# EAGLE schematic Seeeduino GPRS v1.0 (EAGLE 6.4)
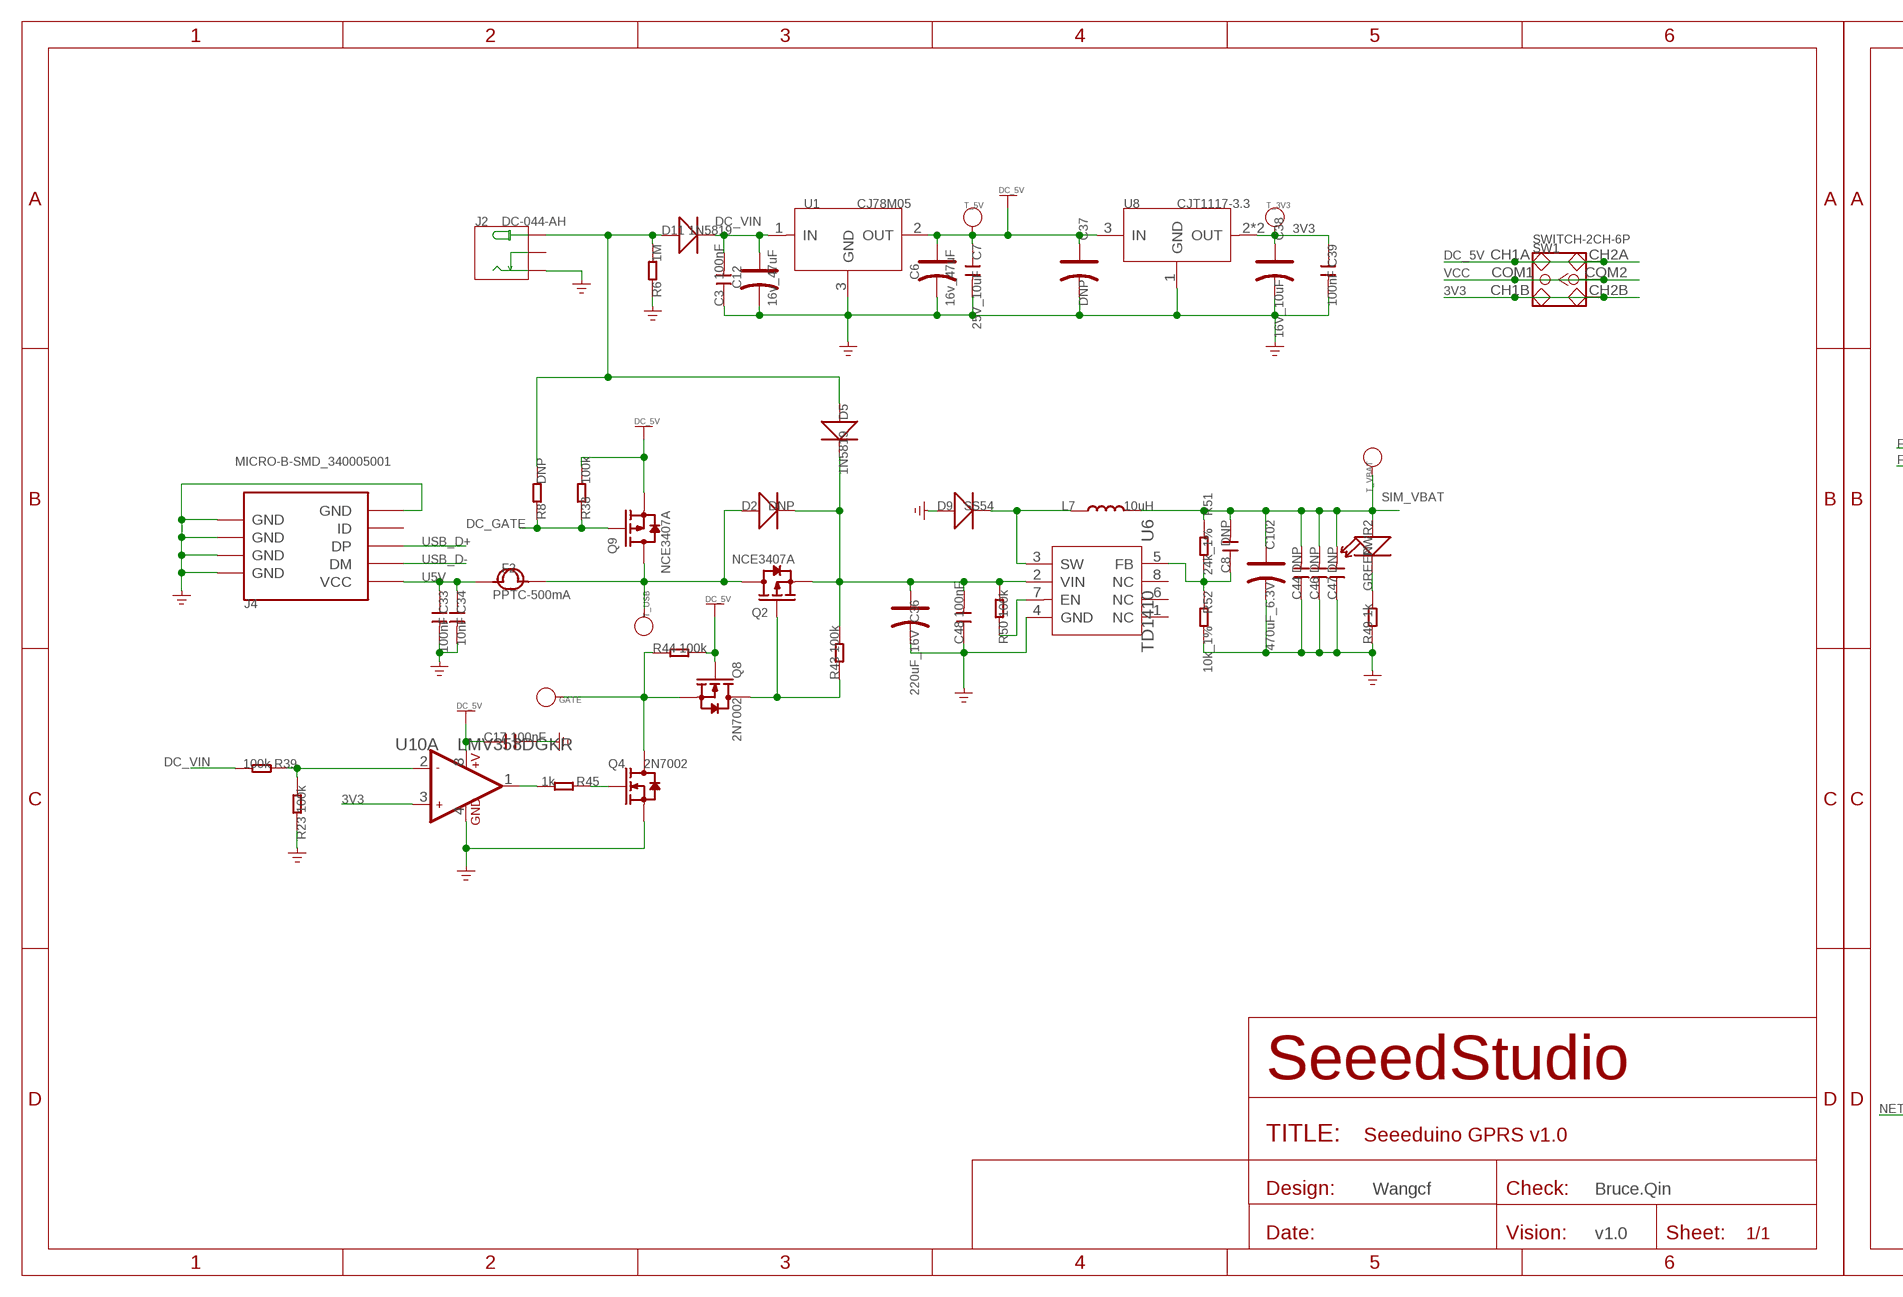
[diagram p0: schematic, sheet 1, part 1 of 3]
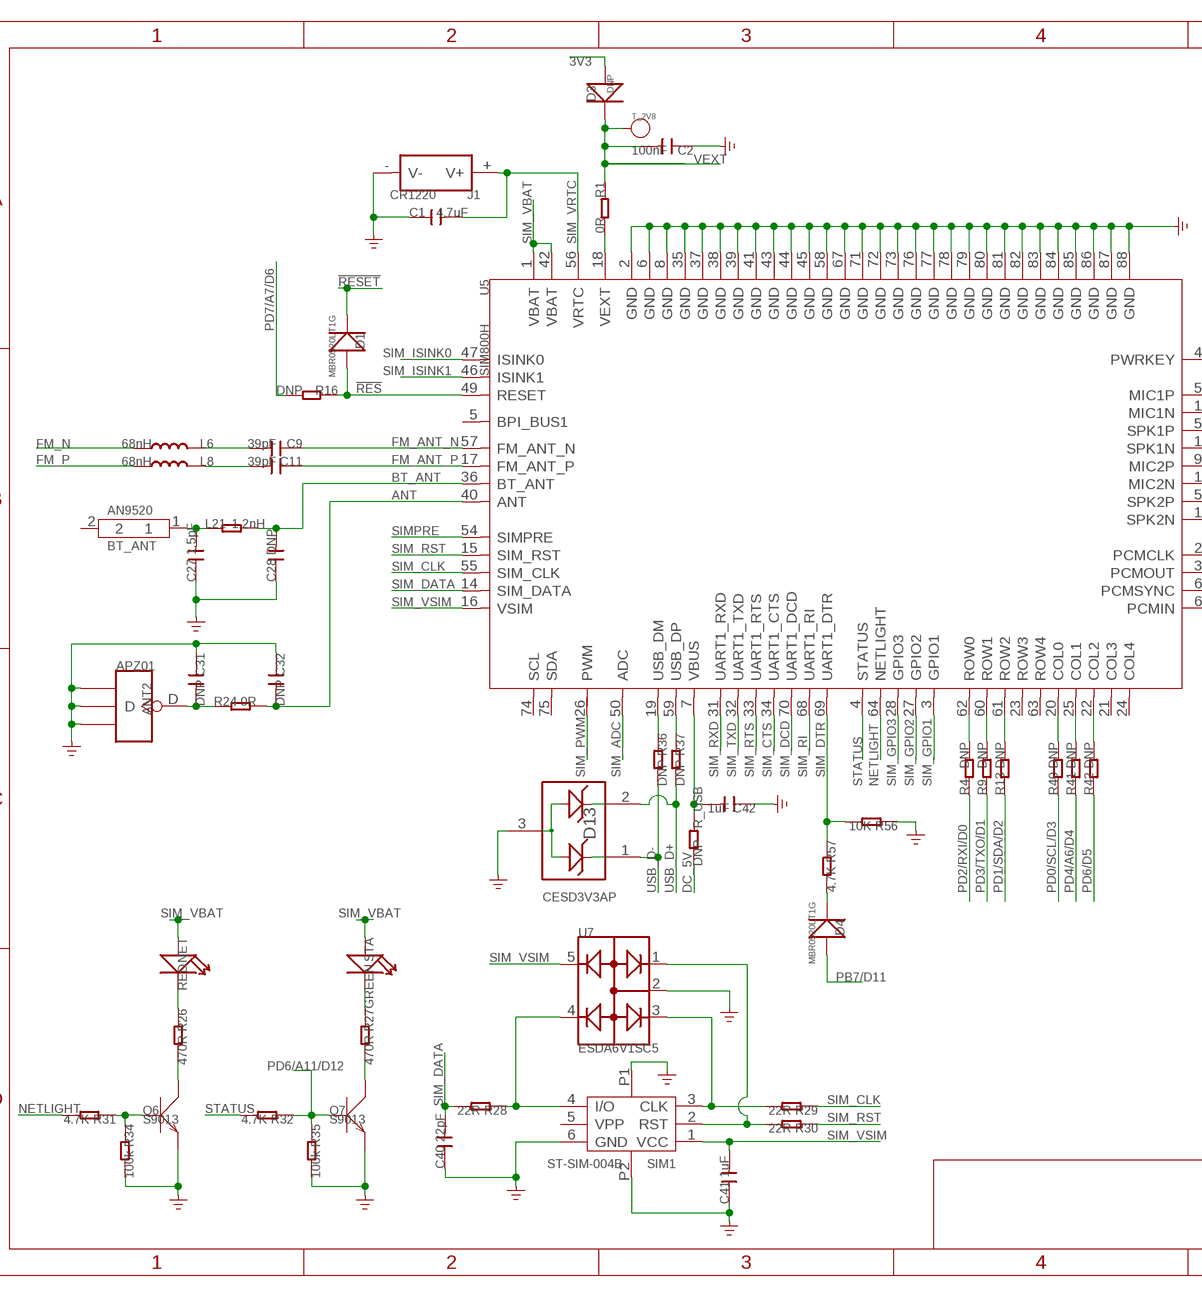
[diagram p1: schematic, sheet 1, part 2 of 3]
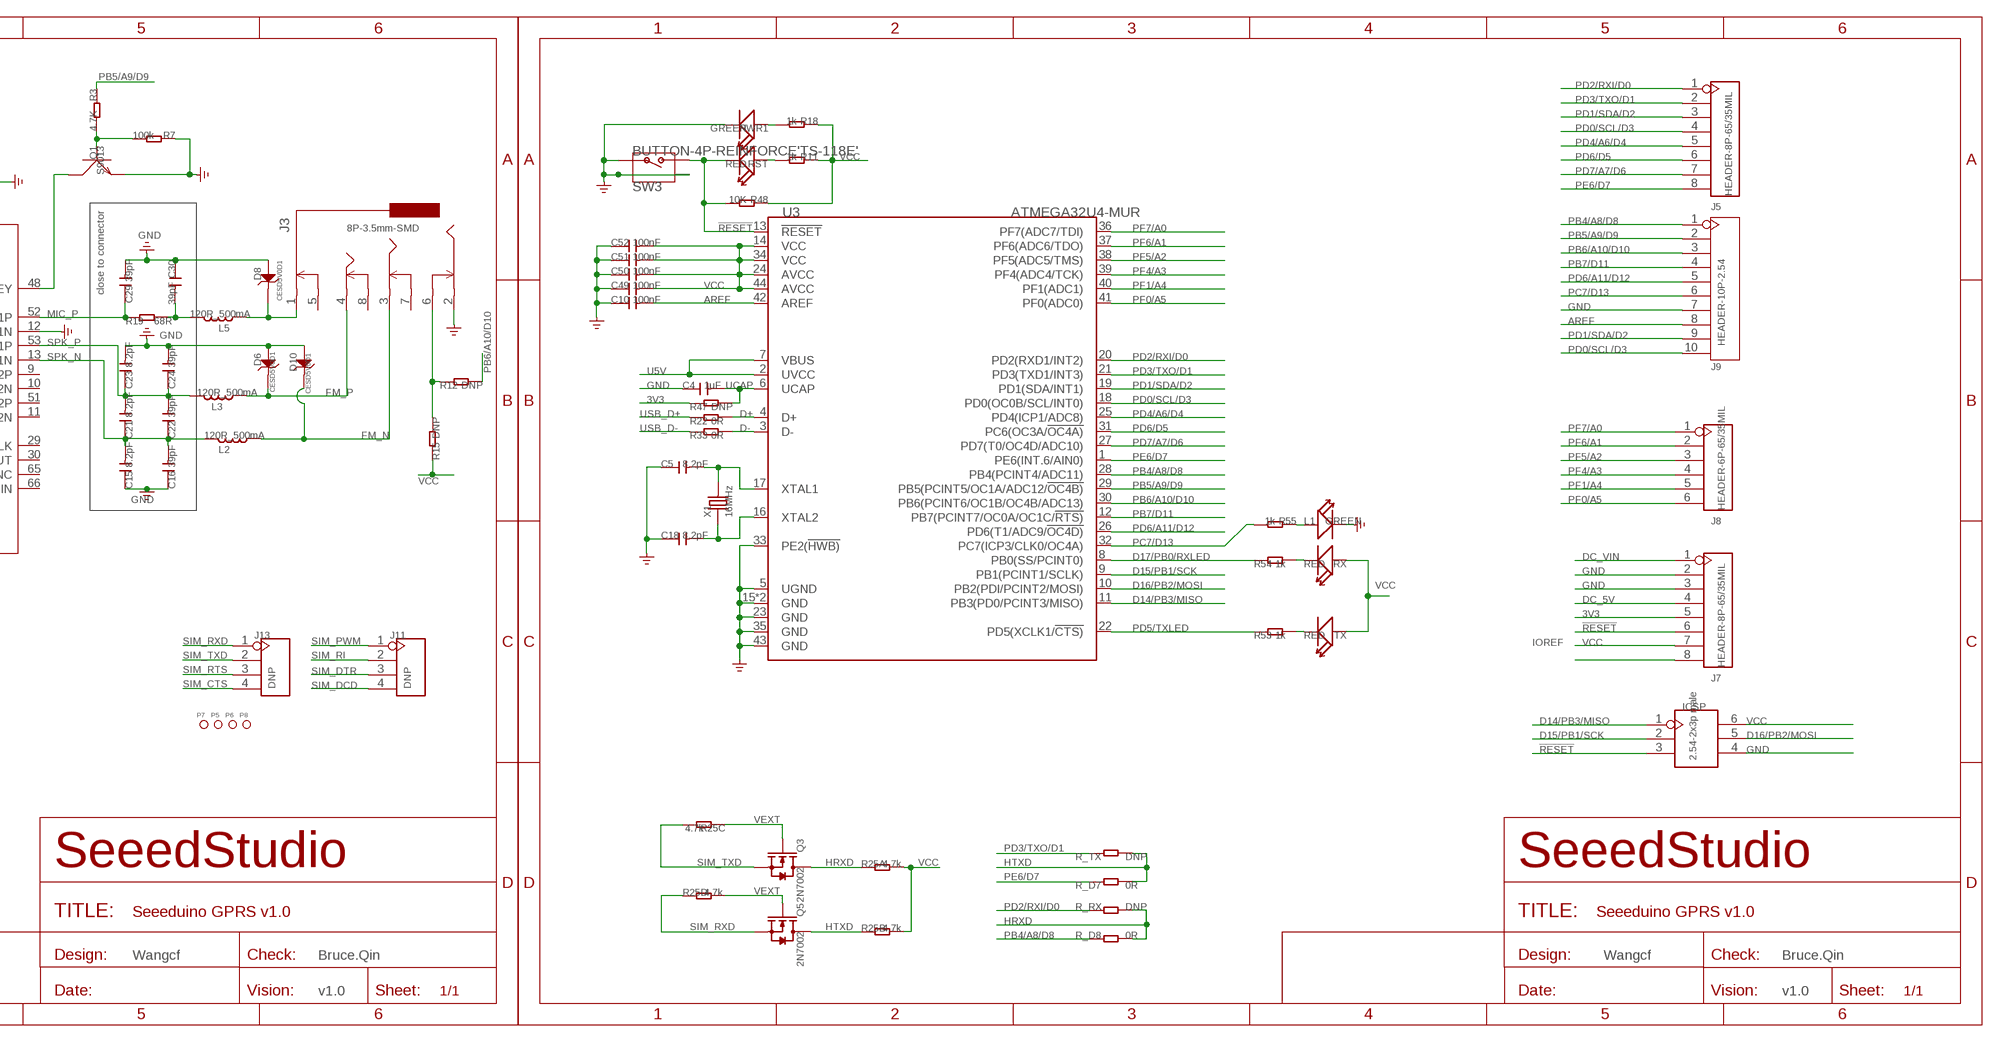
[diagram p2: schematic, sheet 1, part 3 of 3]

## Parts
ANT2  APZ01  ANTENNA-U-FL  [4P-U-FL]
BT_ANT  AN9520  ANTENNA-CERAMICS'AN9520'  [2P-9.5X2.1X1MM]
C1  4.7uF  C-0805  [C0805]
C2  100nF  C-0603  [C0603]
C3  100nF  C-0603  [C0603]
C4  1uF  C-0603  [C0603]
C5  8.2pF  C-0603  [C0603]
C6  16v_47uF  CAP-AVX-C  [AVX-C]
C7  25V_10uF  C-0805  [C0805]
C8  DNP  C-0603  [C0603]
C9  39pF  C-0603  [C0603]
C10  100nF  C-0603  [C0603]
C11  39pF  C-0603  [C0603]
C12  16v_47uF  CAP-AVX-C  [AVX-C]
C15  8.2pF  C-0603  [C0603]
C16  39pF  C-0603  [C0603]
C17  100nF  C-0603  [C0603]
C18  8.2pF  C-0603  [C0603]
C21  8.2pF  C-0603  [C0603]
C22  39pF  C-0603  [C0603]
C23  8.2pF  C-0603  [C0603]
C24  39pF  C-0603  [C0603]
C27  1.5pF  C-0603  [C0603]
C28  DNP  C-0603  [C0603]
C29  39pF  C-0603  [C0603]
C30  39pF  C-0603  [C0603]
C31  DNP  C-0603  [C0603]
C32  DNP  C-0603  [C0603]
C33  100nF  C-0603  [C0603]
C34  10nF  C-0603  [C0603]
C36  220uF_16V  CAP-ELECTRO-D  [ELECTRO-SMD-D-5.6MM]
C37  DNP  CAP-AVX-A  [AVX-A]
C38  16V_10uF  CAP-AVX-A  [AVX-A]
C39  100nF  C-0603  [C0603]
C40  22pF  C-0603  [C0603]
C41  1uF  C-0603  [C0603]
C42  1uF  C-0603  [C0603]
C44  DNP  C-0603  [C0603]
C46  DNP  C-0603  [C0603]
C47  DNP  C-0603  [C0603]
C48  100nF  C-0603  [C0603]
C49  100nF  C-0603  [C0603]
C50  100nF  C-0603  [C0603]
C51  100nF  C-0603  [C0603]
C52  100nF  C-0603  [C0603]
C102  470uF_6.3V  CAP-AVX-D  [AVX-D]
D1  MBR0520LT1G  D'1206'  [SOD123]
D2  DNP  D'B130L-13-F'  [SMA]
D3  DNP  D'1206'  [SOD123]
D4  MBR0520LT1G  D'1206'  [SOD123]
D5  1N5819  D'B130L-13-F'  [SMA]
D6  CESD5V0D1  D-ESD  [SOD123-2.7X1.6]
D8  CESD5V0D1  D-ESD  [SOD123-2.7X1.6]
D9  SS54  D'MBRS240LT3'  [SMB]
D10  CESD5V0D1  D-ESD  [SOD123-2.7X1.6]
D11  1N5819  D'B130L-13-F'  [SMA]
D13  CESD3V3AP  D-ESD-3P  [SOT23]
F2  PPTC-500mA  FUSE  [1206]
GATE  DNP  PAD-TEST-POINT-CIRCLE'4545'  [TP_4545]
ICSP  2.54-2x3p male  HEADER-2X3P-2.54  [2X3P-2.54]
J1  CR1220  HOLDER-BAT  [SMD-CR1220-2]
J2  DC-044-AH  DC-044  [DC-404]
J3  8P-3.5mm-SMD  AUDIO-8P'PJ-3536-L6S'  [8P-3.5-SMD]
J4  MICRO-B-SMD_340005001  USB-MINIUSB-5P-MICRO  [MICRO-USB]
J5  HEADER-8P-65/35MIL  [8P-2.54-65/35MIL]
J7  HEADER-8P-65/35MIL  [8P-2.54-65/35MIL]
J8  HEADER-6P-65/35MIL  [6P-2.54-65/35MIL]
J9  HEADER-10P-2.54  [10P-2.54]
J11  DNP  HEADER-4P-65/35MIL  [4P-65/35MIL]
J13  DNP  HEADER-4P-65/35MIL  [4P-65/35MIL]
L1  GREEN  LED'0603'  [LED-0603]
L2  120R_500mA  L'0603'  [L0603]
L3  120R_500mA  L'0603'  [L0603]
L5  120R_500mA  L'0603'  [L0603]
L6  68nH  L'0603'  [L0603]
L7  10uH  L'0630'  [L0630]
L8  68nH  L'0603'  [L0603]
L21  1.2nH  R-0603  [R0603]
NET  RED  LED'0603'  [LED-0603]
P5  DNP  PAD-MARK  [ROUND-MARK-1.0]
P6  DNP  PAD-MARK  [ROUND-MARK-1.0]
P7  DNP  PAD-MARK  [ROUND-MARK-1.0]
P8  DNP  PAD-MARK  [ROUND-MARK-1.0]
PWR1  GREEN  LED'0603'  [LED-0603]
PWR2  GREEN  LED'0603'  [LED-0603]
Q1  S9013  TRANSISTOR-NPN-SOT23  [SOT23]
Q2  NCE3407A  MOSFET-P'SI2323CDS/SI2305DS<BR>'  [SOT23]
Q3  2N7002  MOSFET-N'SOT23'  [SOT23]
Q4  2N7002  MOSFET-N'SOT23'  [SOT23]
Q5  2N7002  MOSFET-N'SOT23'  [SOT23]
Q6  S9013  TRANSISTOR-NPN-SOT23  [SOT23]
Q7  S9013  TRANSISTOR-NPN-SOT23  [SOT23]
Q8  2N7002  MOSFET-N'SOT23'  [SOT23]
Q9  NCE3407A  MOSFET-P'SI2323CDS/SI2305DS<BR>'  [SOT23]
R1  0R  R-0603  [R0603]
R3  4.7K  R-0603  [R0603]
R4  DNP  R-0603  [R0603]
R6  1M  R-0603  [R0603]
R7  100k  R-0603  [R0603]
R8  DNP  R-0603  [R0603]
R9  DNP  R-0603  [R0603]
R11  1k  R-0603  [R0603]
R12  DNP  R-0603  [R0603]
R13  DNP  R-0603  [R0603]
R15  DNP  R-0603  [R0603]
R16  DNP  R-0603  [R0603]
R18  1k  R-0603  [R0603]
R19  68R  R-0603  [R0603]
R22  0R  R-0603  [R0603]
R23  100k  R-0603  [R0603]
R24  0R  R-0603  [R0603]
R25  4.7k  R-4R-1206  [1206-8-3.3X2.4]
R26  470R  R-0603  [R0603]
R27  470R  R-0603  [R0603]
R28  22R  R-0603  [R0603]
R29  22R  R-0603  [R0603]
R30  22R  R-0603  [R0603]
R31  4.7K  R-0603  [R0603]
R32  4.7K  R-0603  [R0603]
R33  0R  R-0603  [R0603]
R34  100k  R-0603  [R0603]
R35  100k  R-0603  [R0603]
R36  DNP  R-0603  [R0603]
R37  DNP  R-0603  [R0603]
R38  100k  R-0603  [R0603]
R39  100k  R-0603  [R0603]
R40  DNP  R-0603  [R0603]
R41  DNP  R-0603  [R0603]
R42  DNP  R-0603  [R0603]
R43  100k  R-0603  [R0603]
R44  100k  R-0603  [R0603]
R45  1k  R-0603  [R0603]
R47  DNP  R-0603  [R0603]
R48  10K  R-0603  [R0603]
R49  1k  R-0603  [R0603]
R50  100k  R-0603  [R0603]
R51  24k_1%  R-0603  [R0603]
R52  10k_1%  R-0603  [R0603]
R53  1k  R-0603  [R0603]
R54  1k  R-0603  [R0603]
R55  1k  R-0603  [R0603]
R56  10K  R-0603  [R0603]
R57  4.7K  R-0603  [R0603]
R_D7  0R  R-0603  [R0603]
R_D8  0R  R-0603  [R0603]
R_RX  DNP  R-0603  [R0603]
R_TX  DNP  R-0603  [R0603]
R_USB  DNP  R-0603  [R0603]
RST  RED  LED'0603'  [LED-0603]
RX  RED  LED'0603'  [LED-0603]
SIM1  ST-SIM-004B  SIM-CARD'ST-SIM-004B'  [6P-1.8]
STA  GREEN  LED'0603'  [LED-0603]
SW1  SWITCH-2CH-6P  SWITCH-2CH-6P'MS-22D18'  [6P-2CH-2.5-9.1X3.5X3.2H]
SW3  BUTTON-4P-REINFORCE'TS-118E'  [4P-SMD-7X3.5X3.5H]
T_2V8  DNP  PAD-TEST-POINT-CIRCLE'4545'  [TP_4545]
T_3V3  DNP  PAD-TEST-POINT-CIRCLE'4545'  [TP_4545]
T_5V  DNP  PAD-TEST-POINT-CIRCLE'4545'  [TP_4545]
T_USB  DNP  PAD-TEST-POINT-CIRCLE'4545'  [TP_4545]
T_VBAT  DNP  PAD-TEST-POINT-CIRCLE'4545'  [TP_4545]
TX  RED  LED'0603'  [LED-0603]
U1  CJ78M05  78M05-TO252  [TO252]
U3  ATMEGA32U4-MUR  ATMEGA32U4-MU  [QFN44]
U5  SIM800H  [88P-17.8X15.8X2.4H]
U6  TD1410  [SOP8]
U7  ESDA6V1SC5  D-ESD-ESDA6V1SC5-SOT23-5L  [SOT23-5L]
U8  CJT1117-3.3  LD1117S  [SOT-223]
U10  LMV358DGKR  LMV358DGK  [MSOP8]
X1  16MHz  CRYSTAL'5032'  [2P-SMD-5X3.2]

## Nets
3V3: C38.+ C39.1 D3.+ J7.5 R47.1 SW1.CH1B SW1.CH2B T_3V3.T U8.2(OUT) U8.TER(OUT) U10.3(A:+IN1)
!RES: D1.+ R16.1 U5.49(RESET)
!RESET: D1.- ICSP.3 J7.6 R48.2 RST.- SW3.2 U3.13(!RESET)
ANT: C32.2 R24.2 U5.40(ANT)
AREF: C10.2 J9.8 U3.42(AREF)
BT_ANT: C28.2 L21.2 U5.36(BT_ANT)
D14/PB3/MISO: ICSP.1 U3.11(PB3(PD0/PCINT3/MISO))
D15/PB1/SCK: ICSP.2 U3.9(PB1(PCINT1/SCLK))
D16/PB2/MOSI: ICSP.5 U3.10(PB2(PDI/PCINT2/MOSI))
D17/PB0/RXLED: R54.1 U3.8(PB0(SS/PCINT0))
D+: R22.2 U3.4(D+)
D-: R33.2 U3.3(D-)
DC_5V: C6.+ C7.1 C17.1 C37.+ J7.4 Q8.1(G) Q9.2(S) R38.2 R44.2 R_USB.2 SW1.CH1A SW1.CH2A T_5V.T U1.2(OUT) U8.3(IN) U10.8(A:+V)
DC_GATE: GATE.T Q4.3(D) Q8.2(S) Q9.1(G) R8.1 R38.1 R44.1
DC_VIN: C3.2 C12.+ D11.1(-) J7.1 R39.2 U1.1(IN)
FM_ANT: D8.2 J3.1 L5.2
FM_ANT_N: C9.1 U5.57(FM_ANT_N)
FM_ANT_P: C11.1 U5.17(FM_ANT_P)
FM_N: D10.2 J3.3 L2.2 L6.2
FM_P: D6.2 J3.4 L3.2 L8.2
GND: ANT2.GND1 ANT2.GND2 ANT2.GND3 C1.1 C2.1 C3.1 C4.1 C5.1 C6.- C7.2 C10.1 C12.- C15.1 C16.1 C17.2 C18.1 C23.2 C24.2 C27.1 C28.1 C29.2 C30.1 C31.1 C32.1 C33.2 C34.2 C36.- C37.- C38.- C39.2 C40.1 C41.1 C42.1 C44.1 C46.1 C47.1 C48.1 C49.1 C50.1 C51.1 C52.1 C102.- D6.1 D8.1 D9.+ D10.1 D13.3 ICSP.4 J1.-(V-) J2.- J3.2 J4.5(GND) J4.S1(GND) J4.S2(GND) J4.S3(GND) J4.S4(GND) J4.S5(GND) J4.S6(GND) J7.2 J7.3 J9.7 L1.- PWR1.- Q1.2(E) Q4.2(S) Q6.2(E) Q7.2(E) R6.1 R7.1 R23.1 R34.2 R35.2 R49.1 R52.2 R56.1 SIM1.6(GND) SIM1.P1 SIM1.P2 SW3.1 SW3.S1 SW3.S2 U1.3(GND) U3.5(UGND) U3.15(GND) U3.23(GND) U3.33(PE2(!HWB)) U3.35(GND) U3.43(GND) U3.TAB(GND) U5.2(GND) U5.6(GND) U5.8(GND) U5.12(MIC1N) U5.35(GND) U5.37(GND) U5.38(GND) U5.39(GND) U5.41(GND) U5.43(GND) U5.44(GND) U5.45(GND) U5.58(GND) U5.67(GND) U5.71(GND) U5.72(GND) U5.73(GND) U5.76(GND) U5.77(GND) U5.78(GND) U5.79(GND) U5.80(GND) U5.81(GND) U5.82(GND) U5.83(GND) U5.84(GND) U5.85(GND) U5.86(GND) U5.87(GND) U5.88(GND) U6.4(GND) U7.2 U8.1(GND) U10.4(A:GND)
HRXD: Q3.3(D) R25.1 R_D8.2 R_RX.2
HTXD: Q5.3(D) R25.2 R_D7.2 R_TX.2
I/O: R28.1 SIM1.4(I/O) U7.4
MIC_P: C29.1 R19.1 U5.52(MIC1P)
N$2: Q6.1(B) R31.1 R34.1
N$3: Q6.3(C) R26.2
N$4: D4.- R57.2
N$5: R1.2 U5.18(VEXT)
N$6: J7.8
N$7: R23.2 R39.1 U10.2(A:-IN1)
N$8: J3.6 R12.1 R15.2
N$9: R36.1 U5.19(USB_DM)
N$10: C11.2 L8.1
N$11: Q1.1(B) R3.2 R7.2
N$12: C9.2 L6.1
N$13: R30.2 SIM1.2(RST) U7.1
N$14: R29.2 SIM1.3(CLK) U7.3
N$16: R11.2 RST.+
N$17: R37.1 U5.59(USB_DP)
N$18: D2.2(+) F2.2 Q2.3(D) Q9.3(D) T_USB.T
N$19: C42.2 R_USB.1 U5.7(VBUS)
N$20: R4.2 U5.62(ROW0)
N$21: R9.2 U5.60(ROW1)
N$22: R13.2 U5.61(ROW2)
N$26: D5.2(+) D11.2(+) J2.+ R6.2 R8.2
N$27: R45.2 U10.1(A:OUT1)
N$29: NET.- R26.1
N$30: C30.2 L5.1 R19.2
N$31: PWR1.+ R18.2
N$33: R40.2 U5.20(COL0)
N$34: R41.2 U5.25(COL1)
N$35: R42.2 U5.22(COL2)
N$36: Q2.1(G) Q8.3(D) R43.1
N$37: Q4.1(G) R45.1
N$38: C5.2 U3.17(XTAL1) X1.2
N$39: PWR2.- R49.2
N$40: R50.1 U6.7(EN)
N$41: C18.2 U3.16(XTAL2) X1.1
N$42: R53.2 TX.-
N$43: C36.+ C48.2 D2.1(-) D5.1(-) Q2.2(S) R43.2 R50.2 U6.2(VIN)
N$44: C8.1 R51.2 R52.1 U6.5(FB)
N$45: D9.- L7.1 U6.3(SW)
N$46: R54.2 RX.-
N$47: L1.+ R55.1
N$56: Q7.3(C) R27.2
N$57: R27.1 STA.-
N$58: BT_ANT.1 C27.2 L21.1
N$59: ANT2.D C31.2 R24.1
NETLIGHT: R31.2 U5.64(NETLIGHT)
PB4/A8/D8: J9.1 R_D8.1 U3.28(PB4(PCINT4/ADC11))
PB5/A9/D9: J9.2 R3.1 U3.29(PB5(PCINT5/OC1A/ADC12/!OC4B))
PB6/A10/D10: J9.3 R12.2 U3.30(PB6(PCINT6/OC1B/OC4B/ADC13))
PB7/D11: D4.+ J9.4 U3.12(PB7(PCINT7/OC0A/OC1C/!RTS))
PC7/D13: J9.6 R55.2 U3.32(PC7(ICP3/CLK0/OC4A))
PD0/SCL/D3: J5.4 J9.10 R40.1 U3.18(PD0(OC0B/SCL/INT0))
PD1/SDA/D2: J5.3 J9.9 R13.1 U3.19(PD1(SDA/INT1))
PD2/RXI/D0: J5.1 R4.1 R_RX.1 U3.20(PD2(RXD1/INT2))
PD3/TXO/D1: J5.2 R9.1 R_TX.1 U3.21(PD3(TXD1/INT3))
PD4/A6/D4: J5.5 R41.1 U3.25(PD4(ICP1/ADC8))
PD5/TXLED: R53.1 U3.22(PD5(XCLK1/!CTS))
PD6/A11/D12: J9.5 Q7.1(B) R32.1 R35.1 U3.26(PD6(T1/ADC9/!OC4D))
PD6/D5: J5.6 R42.1 U3.31(PC6(OC3A/!OC4A))
PD7/A7/D6: J5.7 R16.2 U3.27(PD7(T0/OC4D/ADC10))
PE6/D7: J5.8 R_D7.1 U3.1(PE6(INT.6/AIN0))
PF0/A5: J8.6 U3.41(PF0(ADC0))
PF1/A4: J8.5 U3.40(PF1(ADC1))
PF4/A3: J8.4 U3.39(PF4(ADC4/TCK))
PF5/A2: J8.3 U3.38(PF5(ADC5/TMS))
PF6/A1: J8.2 U3.37(PF6(ADC6/TDO))
PF7/A0: J8.1 U3.36(PF7(ADC7/TDI))
PWRKEY: Q1.3(C) U5.48(PWRKEY)
SIM_ADC: U5.50(ADC)
SIM_CLK: R29.1 U5.55(SIM_CLK)
SIM_CTS: J13.4 U5.34(UART1_CTS)
SIM_DATA: C40.2 R28.2 U5.14(SIM_DATA)
SIM_DCD: J11.4 U5.70(UART1_DCD)
SIM_DTR: J11.3 R56.2 R57.1 U5.69(UART1_DTR)
SIM_GPIO1: U5.3(GPIO1)
SIM_GPIO2: U5.27(GPIO2)
SIM_GPIO3: U5.28(GPIO3)
SIM_ISINK0: U5.47(ISINK0)
SIM_ISINK1: U5.46(ISINK1)
SIM_PWM: J11.1 U5.26(PWM)
SIM_RI: J11.2 U5.68(UART1_RI)
SIM_RST: R30.1 U5.15(SIM_RST)
SIM_RTS: J13.3 U5.33(UART1_RTS)
SIM_RXD: J13.1 Q5.2(S) R25.4 U5.31(UART1_RXD)
SIM_TXD: J13.2 Q3.2(S) R25.6 U5.32(UART1_TXD)
SIM_VBAT: C8.2 C44.2 C46.2 C47.2 C102.+ L7.2 NET.+ PWR2.+ R51.1 STA.+ T_VBAT.T U5.1(VBAT) U5.42(VBAT)
SIM_VRTC: C1.2 J1.+(V+) U5.56(VRTC)
SIM_VSIM: C41.2 SIM1.1(VCC) U5.16(VSIM) U7.5
SIMPRE: U5.54(SIMPRE)
SPK_N: C15.2 C16.2 C21.1 C22.1 L2.1 U5.13(SPK1N)
SPK_P: C21.2 C22.2 C23.1 C24.1 L3.1 U5.53(SPK1P)
STATUS: R32.2 U5.4(STATUS)
U5V: C33.1 C34.1 F2.1 J4.1(VCC) U3.2(UVCC) U3.7(VBUS)
UCAP: C4.2 R47.2 U3.6(UCAP)
USB_D+: D13.2 J4.3(DP) R22.1 R37.2
USB_D-: D13.1 J4.2(DM) R33.1 R36.2
VCC: C49.2 C50.2 C51.2 C52.2 ICSP.6 J7.7 R11.1 R15.1 R18.1 R25.7 R25.8 R48.1 RX.+ SW1.COM1 SW1.COM2 TX.+ U3.14(VCC) U3.24(AVCC) U3.34(VCC) U3.44(AVCC)
VEXT: C2.2 D3.- Q3.1(G) Q5.1(G) R1.1 R25.3 R25.5 T_2V8.T
Unconnected: BT_ANT.2 J2.CDN J3.5 J3.7 J3.8 J4.4(ID) SIM1.5(VPP) U5.5(BPI_BUS1) U5.9(MIC2P) U5.10(MIC2N) U5.11(SPK2N) U5.21(COL3) U5.23(ROW3) U5.24(COL4) U5.29(PCMCLK) U5.30(PCMOUT) U5.51(SPK2P) U5.63(ROW4) U5.65(PCMSYNC) U5.66(PCMIN) U5.74(SCL) U5.75(SDA) U6.1(NC) U6.6(NC) U6.8(NC) U10.5(B:+IN2) U10.6(B:-IN2) U10.7(B:OUT2)

## Notes on the sheet
- close to connector
- IOREF
- Wangcf | Bruce.Qin | Wangcf | Bruce.Qin | Wangcf | Bruce.Qin
- v1.0 | v1.0 | v1.0

## Library data of the parts
ANT2 = Connector:ANTENNA-U-FL
BT_ANT = Connector :ANTENNA-CERAMICS: Multilayer Chip Antenna for 2.4GHz Wireless Communication
C1-C5 C7-C11 C15-C18 C21-C24 C27-C34 C39-C42 C44 C46-C52 = Discrete:C*: Ceramic Capacitors
C6 C12 C36-C38 C102 = Discrete:CAP*: Electrolytic Capacitors,Tantalum Capacitors and Super Capacitors
D1-D5 D9 D11 = Discrete:D*
D6 D8 D10 = template:D-ESD: Diodes for Protectiong against ESD
D13 = Discrete:D-ESD-3P
F2 = Discrete:FUSE
GATE T_2V8 T_3V3 T_5V T_USB T_VBAT = Discrete:PAD-TEST-POINT-CIRCLE; PARTNO: DNP
ICSP = Connector:HEADER-2X3P
J1 = Connector:HOLDER-BAT: button cell holder
J2 = For_Test_Albert:DC-044
J3 = template:AUDIO-8P
J4 = Connector :USB-MINIUSB-5P
J5 J7 = Connector:HEADER-8P
J8 = Connector:HEADER-6P
J9 = Connector:HEADER-10P
J11 J13 = Connector :HEADER-4P
L1 NET PWR1 PWR2 RST RX STA TX = Discrete:LED*
L2 L3 L5-L8 = Discrete:L*
L21 R1 R3 R4 R6-R9 R11-R13 R15 R16 R18 R19 R22-R24 R26-R45 R47-R57 R_D7 R_D8 R_RX R_TX R_USB = Discrete:R*
P5-P8 = Discrete:PAD-MARK; PARTNO: DNP
Q1 Q6 Q7 = Discrete:TRANSISTOR-NPN*: NPN audion
Q2 Q9 = Discrete:MOSFET-P
Q3-Q5 Q8 = Discrete:MOSFET-N: IRLL014: http://www.vishay.com/docs/91319/sihll014.pdf
R25 = Discrete:R-4R*: Resistor Array
SIM1 = template:SIM-CARD
SW1 = Discrete:SWITCH-2CH-6P
SW3 = Discrete:BUTTON-4P-REINFORCE: TS-1188E http://www.best-dz.com/?thread-374-2.html
U1 = IC:78M05: 0.5A Three Terminal Positive Voltage Regulators
U3 = IC:ATMEGA32U4: 8-bit Microcontroller With 16/32K Bytes of ISP Flash and USB controller
U5 = template:SIM800H
U6 = template:TD1410: 2A 380KHz 20V PWM Buck DC/DC Converter
U7 = Discrete:D-ESD-ESDA6V1SC5: Quad Transil array for ESD protection STMicroelectronics http://www.st.com/internet/com/TECHNICAL_RESOURCES/TECHNICAL_LITERATURE/DATASHEET/CD00002055.pdf
U8 = IC:LD1117: Low Drop Fixed And Adjustable Positive Voltage Regulators http://www.datasheetcatalog.org/datasheet/SGSThomsonMicroelectronics/mXuqtqv.pdf
U10 = IC:LMV358: General purpose LOW Voltage, Rail-to-Rail Output Amplifiers http://www.fairchildsemi.com/ds/LM/LMV358.pdf
X1 = Discrete:CRYSTAL*: CRYSTAL

## Net classes
0 default: width 0.152 mm, drill 0.305 mm, clearance 0.152 mm
3 none3: width 0.203 mm, drill 0.305 mm, clearance 0.203 mm